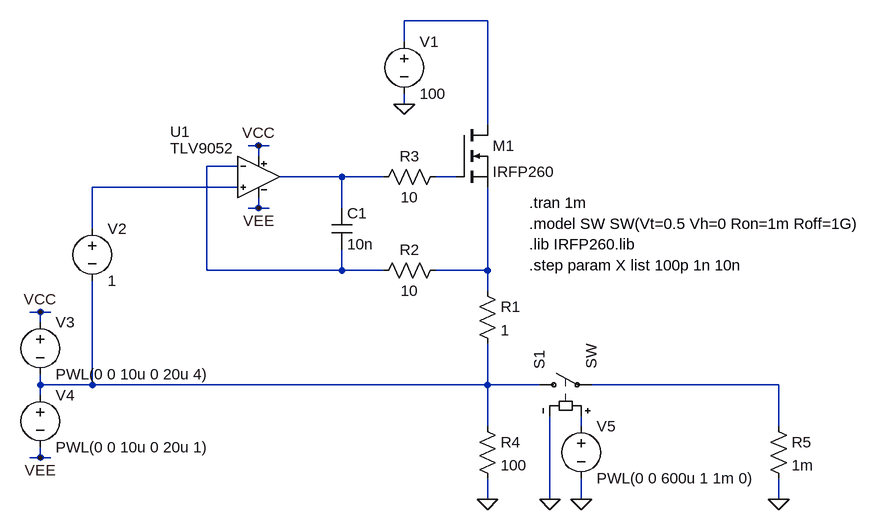
[diagram p0: schematic Pass.asc]
Pass.asc, the LTspice schematic file:
Version 4
SHEET 1 1156 852
WIRE -288 80 -416 80
WIRE -416 112 -416 80
WIRE -416 208 -416 192
WIRE -288 240 -288 80
WIRE -640 272 -656 272
WIRE -624 272 -640 272
WIRE -640 288 -640 272
WIRE -672 304 -720 304
WIRE -512 320 -608 320
WIRE -448 320 -512 320
WIRE -336 320 -368 320
WIRE -672 336 -896 336
WIRE -640 368 -640 352
WIRE -640 368 -656 368
WIRE -624 368 -640 368
WIRE -512 368 -512 320
WIRE -896 400 -896 336
WIRE -720 464 -720 304
WIRE -512 464 -512 432
WIRE -512 464 -720 464
WIRE -448 464 -512 464
WIRE -288 464 -288 336
WIRE -288 464 -368 464
WIRE -288 496 -288 464
WIRE -976 528 -992 528
WIRE -960 528 -976 528
WIRE -976 544 -976 528
WIRE -976 640 -976 624
WIRE -896 640 -896 480
WIRE -896 640 -976 640
WIRE -288 640 -288 576
WIRE -288 640 -896 640
WIRE -208 640 -288 640
WIRE 160 640 -128 640
WIRE -976 656 -976 640
WIRE -288 704 -288 640
WIRE -144 704 -144 688
WIRE 160 704 160 640
WIRE -976 752 -976 736
WIRE -976 752 -992 752
WIRE -960 752 -976 752
WIRE -288 816 -288 784
WIRE -192 816 -192 688
WIRE -144 816 -144 784
WIRE 160 816 160 784
FLAG -640 272 VCC
FLAG -640 368 VEE
FLAG -976 528 VCC
FLAG -976 752 VEE
FLAG -288 816 0
FLAG -416 208 0
FLAG 160 816 0
FLAG -192 816 0
FLAG -144 816 0
SYMBOL nmos -336 240 R0
SYMATTR InstName M1
SYMATTR Value IRFP260
SYMATTR Prefix X
SYMBOL voltage -416 96 R0
WINDOW 123 0 0 Left 0
WINDOW 39 0 0 Left 0
SYMATTR InstName V1
SYMATTR Value 100
SYMBOL res -304 480 R0
SYMATTR InstName R1
SYMATTR Value 1
SYMBOL voltage -896 384 R0
WINDOW 123 0 0 Left 0
WINDOW 39 0 0 Left 0
SYMATTR InstName V2
SYMATTR Value 1
SYMBOL voltage -976 528 R0
WINDOW 123 0 0 Left 0
WINDOW 39 0 0 Left 0
SYMATTR InstName V3
SYMATTR Value PWL(0 0 10u 0 20u 4)
SYMBOL res -304 688 R0
SYMATTR InstName R4
SYMATTR Value 100
SYMBOL res 144 688 R0
SYMATTR InstName R5
SYMATTR Value 1m
SYMBOL sw -224 640 R270
SYMATTR InstName S1
SYMBOL voltage -144 688 R0
WINDOW 123 0 0 Left 0
WINDOW 39 0 0 Left 0
SYMATTR InstName V5
SYMATTR Value PWL(0 0 600u 1 1m 0)
SYMBOL voltage -976 640 R0
WINDOW 123 0 0 Left 0
WINDOW 39 0 0 Left 0
SYMATTR InstName V4
SYMATTR Value PWL(0 0 10u 0 20u 1)
SYMBOL res -352 304 R90
WINDOW 0 0 56 VBottom 2
WINDOW 3 32 56 VTop 2
SYMATTR InstName R3
SYMATTR Value 10
SYMBOL TLV9052 -640 320 R0
WINDOW 0 -136 -69 Left 2
WINDOW 38 -136 -44 Left 2
SYMATTR InstName U1
SYMBOL cap -528 368 R0
SYMATTR InstName C1
SYMATTR Value 10n
SYMBOL res -352 448 R90
WINDOW 0 0 56 VBottom 2
WINDOW 3 32 56 VTop 2
SYMATTR InstName R2
SYMATTR Value 10
TEXT -224 392 Left 2 !.model SW SW(Vt=0.5 Vh=0 Ron=1m Roff=1G)
TEXT -224 360 Left 2 !.tran 1m
TEXT -224 424 Left 2 !.lib IRFP260.lib
TEXT -224 456 Left 2 !.step param X list 100p 1n 10n

The netlist it stands for:
* Pass.asc
XM1 N001 N004 N006 IRFP260  ; pins D G S
V1 N001 0 100
R1 N006 N007 1
V2 N005 N007 1
V3 VCC N007 PWL(0 0 10u 0 20u 4)
R4 N007 0 100
R5 N008 0 1m
S1 N007 N008 N009 0 SW
V5 N009 0 PWL(0 0 600u 1 1m 0)
V4 N007 VEE PWL(0 0 10u 0 20u 1)
R3 N004 N003 10
XU1 N005 N002 VCC VEE N003 TLV9052  ; pins In+ In- V+ V- OUT
C1 N003 N002 10n
R2 N006 N002 10
.model SW SW(Vt=0.5 Vh=0 Ron=1m Roff=1G)
.tran 1m
.lib IRFP260.lib
.step param X list 100p 1n 10n
.lib TLV9052.lib
.backanno
.end